# Altium schematic sheet LISC_SensorIO.SchDoc: LISC
size A4; Date: 2018-04-21; Author: EP; Organization: eptecon; Revision: A; SheetNumber: 5; SheetTotal: 5; PartNumber: 200511-000; DesignStatus: in progress; Project: LISC-XC95144XL; SheetTitle: Sensor I/O; ProjectName: Project Name
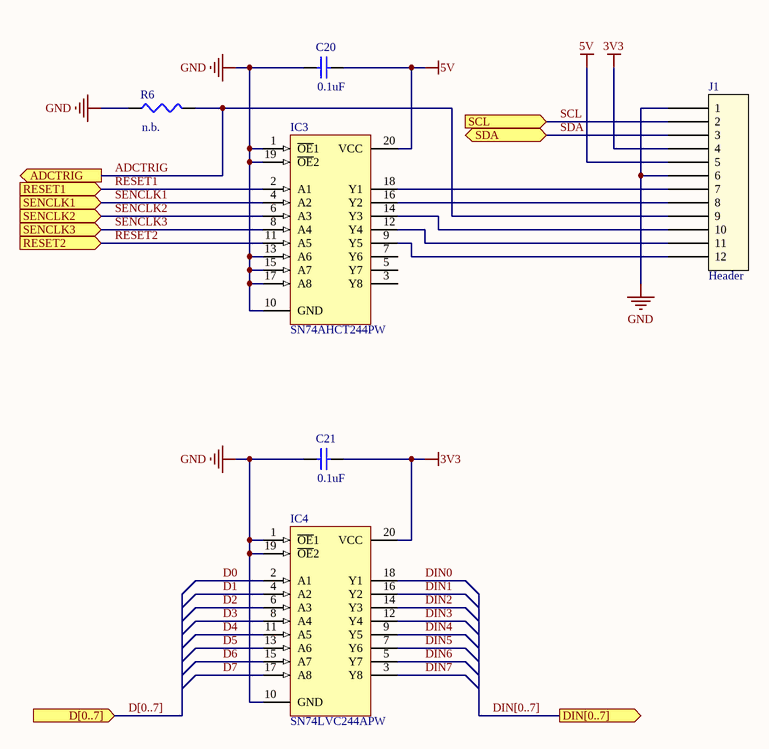
[diagram p0: LISC_SensorIO.SchDoc]

## Parts
C20  value 0.1uF  [1608[0603]]
C21  value 0.1uF  [1608[0603]]
IC3  SN74AHCT244PW  [PW020_M]
IC4  SN74LVC244APW  [PW020_M]
J1  Header  [Molex_Picoflex_12]
R6  value n.b.  [J1-0603]

## Ports
ADCTRIG (out), D[0..7] (in), DIN[0..7] (out), RESET1 (in), RESET2 (in), SCL (in), SDA (bidir), SENCLK1 (in), SENCLK2 (in), SENCLK3 (in)

## Nets
3V3: C21.2 IC4.20(VCC) J1.4
5V: C20.2 IC3.20(VCC) J1.5
GND: C20.1 C21.1 IC3.1(~{OE}1) IC3.10(GND) IC3.13(A6) IC3.15(A7) IC3.17(A8) IC3.19(~{OE}2) IC4.1(~{OE}1) IC4.10(GND) IC4.19(~{OE}2) J1.1 J1.6 R6.1
ADCTRIG: J1.9 R6.2 ; port ADCTRIG
D0: IC4.2(A1)
D1: IC4.4(A2)
D2: IC4.6(A3)
D3: IC4.8(A4)
D4: IC4.11(A5)
D5: IC4.13(A6)
D6: IC4.15(A7)
D7: IC4.17(A8)
DIN0: IC4.18(Y1)
DIN1: IC4.16(Y2)
DIN2: IC4.14(Y3)
DIN3: IC4.12(Y4)
DIN4: IC4.9(Y5)
DIN5: IC4.7(Y6)
DIN6: IC4.5(Y7)
DIN7: IC4.3(Y8)
RESET1: IC3.2(A1) ; port RESET1
RESET2: IC3.11(A5) ; port RESET2
SCL: J1.2 ; port SCL
SDA: J1.3 ; port SDA
SENCLK1: IC3.4(A2) ; port SENCLK1
SENCLK2: IC3.6(A3) ; port SENCLK2
SENCLK3: IC3.8(A4) ; port SENCLK3
NetIC3_9: IC3.9(Y5) J1.12
NetIC3_12: IC3.12(Y4) J1.11
NetIC3_14: IC3.14(Y3) J1.10
NetIC3_16: IC3.16(Y2) J1.8
NetIC3_18: IC3.18(Y1) J1.7

Not connected (* = marked no-connect by the designer): IC3 3(Y8) 5(Y7) 7(Y6)

## Buses and harness runs
bus D[0..7] = port D[0..7]
bus DIN[0..7] = port DIN[0..7]

## Notes on the sheet
- The reproduction, distribution and utilization of this document as well as communication of its content to others without express authorization is prohibited.
- Offenders will be held liable for the payment of damages.
- All rights reserved in the event of the grant of a patent, utility model or design.
- Project:
- Status:
- Created by:
- Reviewed by:
- Date:
- Name:
- Title:
- Part number:
- Revision:
- Size:
- Sheet:
- of:
- Released by:
- A4

## Library data of the parts
C20 C21 = Cap Semi: Capacitor (Semiconductor SIM Model); Published: 8-Jun-2000; LatestRevisionDate: 29-May-2009; LatestRevisionNote: IPC-7351 Footprint Added.; PackageReference: C1206; Publisher: Altium Limited; PackageDescription: Chip Capacitor
IC3 = SN74AHCT244PWLE: Octal Buffer/Driver with 3-State Outputs; ComponentAvailability: Obsolete; Published: 8-Jun-2000; LatestRevisionDate: 16-Oct-2006; LatestRevisionNote: IPC-7351 Footprint Added.; DatasheetVersion: Oct-1998; PackageVersion: Feb-1999; PackageReference: PW020; Publisher: Altium Limited; PackageDescription: 20-Pin Thin Small Outline Package 0.65 mm Pitch; ComponentLink1Description: Manufacturer Link; ComponentLink1URL: http://www.ti.com/; ComponentLink2Description: Datasheet; ComponentLink2URL: http://www-s.ti.com/sc/ds/sn74ahct244.pdf
IC4 = SN74LVC244APW: Octal Buffer/Driver with 3-State Outputs; Published: 8-Jun-2000; LatestRevisionDate: 16-Oct-2006; LatestRevisionNote: IPC-7351 Footprint Added.; DatasheetVersion: Apr-1999; PackageVersion: Feb-1999; PackageReference: PW020; Publisher: Altium Limited; PackageDescription: 20-Pin Thin Small Outline Package 0.65 mm Pitch; ComponentLink1Description: Manufacturer Link; ComponentLink1URL: http://www.ti.com/; ComponentLink2Description: Datasheet; ComponentLink2URL: http://www-s.ti.com/sc/ds/sn74lvc244a.pdf
J1 = Header: Molex Picoflex 12pol.
R6 = Res3: Resistor; Published: 8-Jun-2000; LatestRevisionDate: 29-May-2009; LatestRevisionNote: IPC-7351 Footprint Added.; PackageReference: J1-0603; Publisher: Altium Limited; PackageDescription: Chip Resistor